# Altium project INDUCTANCE_METER.PrjPcb
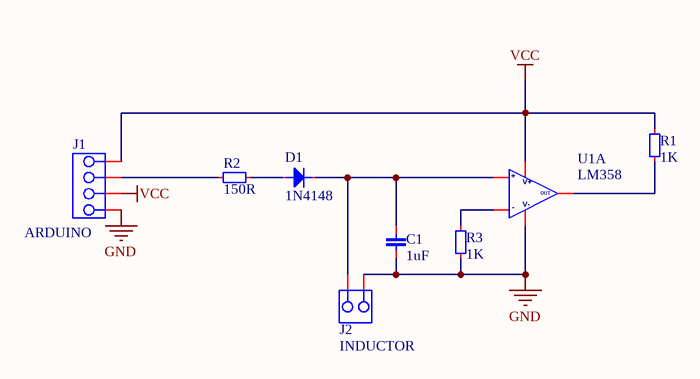
[diagram p0: INDUCTANCE_METER.SchDoc]
1 sheet, 8 parts. Net scope: global (net labels, ports and power ports of the same name join across sheets).
Board file: INDUCTANCE_METER.PcbDoc

## Sheet INDUCTANCE_METER.SchDoc
size A; SheetNumber: 1; SheetTotal: 1

### Parts
C1  1uF  [CAP_DISC_4x3_YL]
D1  1N4148  [DO-204AH-RD]
J1  ARDUINO  [HEADER-MALE-04PINS-2.54MM]
J2  INDUCTOR  [DG306-5.0-02P-12-00AH]
R1  1K  [RES-0.25W-H-CF]
R2  150R  [RES-0.25W-H-CF]
R3  1K  [RES-0.25W-H-CF]
U1  LM358  [DIP-8]  (part A of 2)

### Nets
GND: C1.1 J1.4 J2.2 R3.1 U1.4
VCC: J1.1 J1.3 R1.2 U1.8
NetC1_2: C1.2 D1.2 J2.1 U1.3(+)
NetD1_1: D1.1 R2.1
NetJ1_2: J1.2 R2.2
NetR1_1: R1.1 U1.1(OUT)
NetR3_2: R3.2 U1.2(-)

### Notes on the sheet
- (in symbol Oamp-LM358, part A) V+; V-

### Library data of the parts
C1 = Capacitors(Disc)
D1 = Diode-1N4148
J1 = HEADER-MALE-04PINS-2.54MM
J2 = DG306-5.0-02P-12-00AH
R1-R3 = Resistors THD
U1 = Oamp-LM358